# Altium schematic sheet atmel.SchDoc
size A4; SheetNumber: 4; SheetTotal: 7; SPICEModelCacheDHJLCGBX: <root> / <DocumentId>DHJLCGBX</DocumentId> / <CacheFrame Number="0"> / <Model Name="0603_150060as75000" Kind="CKT"> / <Text>************************************************** / * Manufacturer:           Wurth Elektronik / * Kinds:                  SMT Mono-color Chip LED Waterclear / * Matchcode:              WL-SMCW / * Library Type:           LTspice / * Version:                rev22a / * Created/modified by:    Ella / * Date and Time:          2022-02-18 / * Team:                   eiSos EDA Service / * Contact:                libraries@we-online.com / ************************************************** / * Copyright(C) 2022 WĂĽrth Elektronik eiSos GmbH &amp; Co. KG / * All Rights Reserved. / ************************************************** / * Disclaimer: While WĂĽrth Elektronik eiSos has made every reasonable effort to ensure the accuracy / * of the simulation models provided, WĂĽrth Elektronik eiSos does not guarantee the exemption of error on / * the simulation models, nor does WĂĽrth Elektronik eiSos guarantee that the simulation model is current. / * WĂĽrth Elektronik eiSos reserves the right to make any adjustments at any time without notice. / * WĂĽrth Elektronik eiSos expressly disclaims all implied warranties regarding this simulation model. / ************************************************** / .subckt 0603_150060AS75000  1  2 / D1 1 2 SMCW / .MODEL SMCW D / + IS=10.010E-21 / + N=1.8643 / + RS=1.0000E-6 / + IKF=999 / + CJO=1.0000E-12 / + M=.3333 / + VJ=.75 / + BV=100 / + TT=5.0000E-9 / .ends</Text> / </Model> / </CacheFrame> / </root>
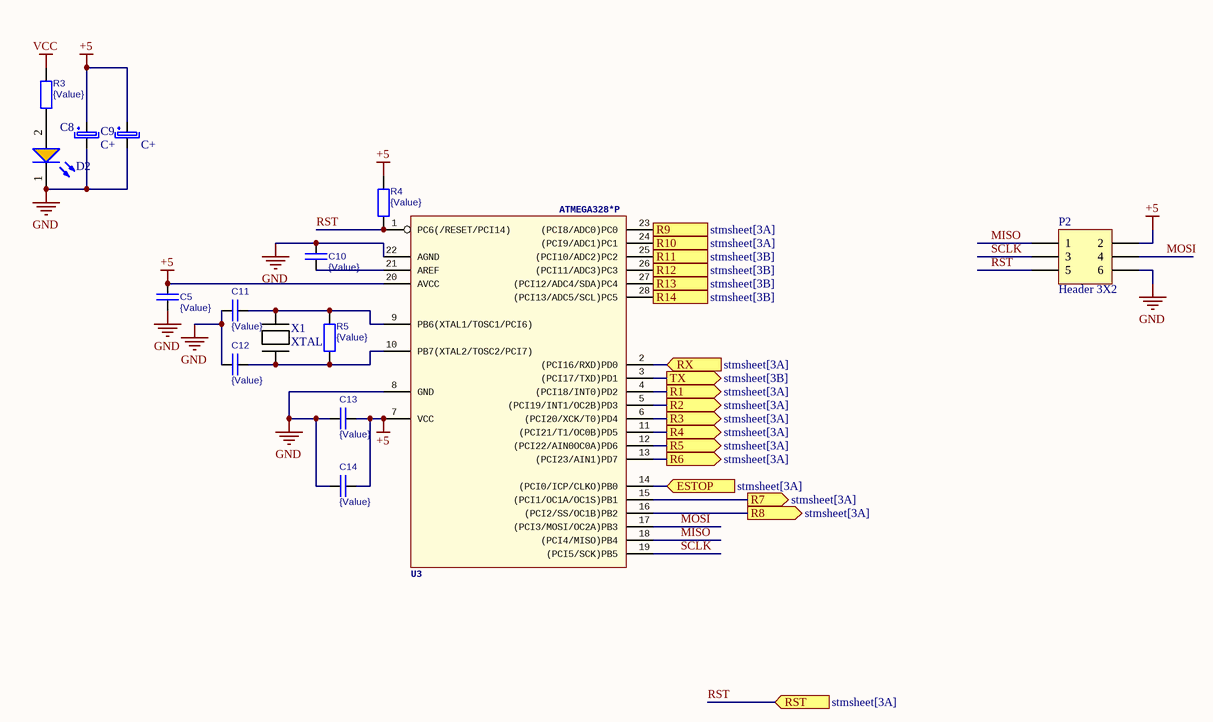
[diagram p0: atmel.SchDoc]

## Parts
C5  {Value}  [C0603]
C8  C+  [C AlElko 5x11 R2]
C9  C+  [C AlElko 5x11 R2]
C10  {Value}  [C0603]
C11  {Value}  [C0603]
C12  {Value}  [C0603]
C13  {Value}  [C0603]
C14  {Value}  [C0603]
D2  Amber, 2V, 140°  [WL-SMCW_0603_150060xx75000]  (value not drawn)
P2  Header 3X2  [HDR2X3]
R3  {Value}  [R0603]
R4  {Value}  [R0603]
R5  {Value}  [R0603]
U3  ATMEGA328*P  [DIL28-3]
X1  XTAL  [XTAL]

## Ports
ESTOP (in, see stmsheet[3A]), R1 (out, see stmsheet[3A]), R2 (out, see stmsheet[3A]), R3 (out, see stmsheet[3A]), R4 (out, see stmsheet[3A]), R5 (out, see stmsheet[3A]), R6 (out, see stmsheet[3A]), R7 (out, see stmsheet[3A]), R8 (out, see stmsheet[3A]), R9 (out, see stmsheet[3A]), R10 (out, see stmsheet[3A]), R11 (out, see stmsheet[3B]), R12 (out, see stmsheet[3B]), R13 (out, see stmsheet[3B]), R14 (out, see stmsheet[3B]), RST (in, see stmsheet[3A]), RX (in, see stmsheet[3A]), TX (out, see stmsheet[3B])

## Nets
+5: C5.1 C8.1 C9.1 C13.2 C14.2 P2.2 R4.1 U3.7(VCC) U3.20(AVCC)
GND: C5.2 C8.2 C9.2 C10.1 C11.1 C12.1 C13.1 C14.1 D2.1(K) P2.6 U3.8(GND) U3.22(AGND)
VCC: R3.1
ESTOP: U3.14((PCI0/ICP/CLKO)PB0) ; port ESTOP
MISO: P2.1 U3.18((PCI4/MISO)PB4)
MOSI: P2.4 U3.17((PCI3/MOSI/OC2A)PB3)
R1: U3.4((PCI18/INT0)PD2) ; port R1
R2: U3.5((PCI19/INT1/OC2B)PD3) ; port R2
R3: U3.6((PCI20/XCK/T0)PD4) ; port R3
R4: U3.11((PCI21/T1/OC0B)PD5) ; port R4
R5: U3.12((PCI22/AIN0OC0A)PD6) ; port R5
R6: U3.13((PCI23/AIN1)PD7) ; port R6
R7: U3.15((PCI1/OC1A/OC1S)PB1) ; port R7
R8: U3.16((PCI2/SS/OC1B)PB2) ; port R8
R9: U3.23((PCI8/ADC0)PC0) ; port R9
R10: U3.24((PCI9/ADC1)PC1) ; port R10
R11: U3.25((PCI10/ADC2)PC2) ; port R11
R12: U3.26((PCI11/ADC3)PC3) ; port R12
R13: U3.27((PCI12/ADC4/SDA)PC4) ; port R13
R14: U3.28((PCI13/ADC5/SCL)PC5) ; port R14
RST: P2.5 R4.2 U3.1(PC6(/RESET/PCI14)) ; port RST
RX: U3.2((PCI16/RXD)PD0) ; port RX
SCLK: P2.3 U3.19((PCI5/SCK)PB5)
TX: U3.3((PCI17/TXD)PD1) ; port TX
NetC10_2: C10.2 U3.21(AREF)
NetC11_2: C11.2 R5.1 U3.9(PB6(XTAL1/TOSC1/PCI6)) X1.2
NetC12_2: C12.2 R5.2 U3.10(PB7(XTAL2/TOSC2/PCI7)) X1.1
NetD2_2: D2.2(A) R3.2

## Library data of the parts
C5 C10-C14 = C: Capacitor; Value: {Value}
C8 C9 = C+: Capacitor Polarized
D2 = 150060AS75000: WL-SMCW Mono-color Chip LED Waterclear, size 0603, Amber, 2V, 140°; Manufacturer: Wurth Elektronik; Case/Size Code: 0603; Chip Technology: AlInGaP; Dominant Wavelength: 605nm; Luminous Intensity: 130mcd; Peak Wavelength: 610nm; Manufacturer Part Number: 150060AS75000; Category: Signal LEDs; Match Code: WL-SMCW; ComponentLink1Description: Website Link; ComponentLink1URL: https://www.we-online.com/redexpert/article/150060AS75000?ad; ComponentLink2Description: Datasheet Link; ComponentLink2URL: https://www.we-online.com/redexpert/spec/150060AS75000?ad; Mount: Surface Mount; Operating Temperature Max: 85°C; Operating Temperature Min: -40°C; Packaging: Tape and Reel; Length: 1.6mm; Width: 0.8mm; Height: 0.7mm; Emitting Color: Amber; Forward Voltage: 2V; Viewing Angle: 140°
P2 = Header 3X2: Header, 3-Pin, Dual row; LatestRevisionDate: 17-Jul-2002; LatestRevisionNote: Re-released for DXP Platform.; Publisher: Altium Limited
R3-R5 = R: Value: {Value}
U3 = ATMEGA328*P: GateName_1: G$1; SymbolName_1: MEGA328; LibraryName: atmega328; DeviceSetName: ATMEGA328*P; Package: DIL28-3